# EAGLE design PS2Kbd (EAGLE 6.5.0)
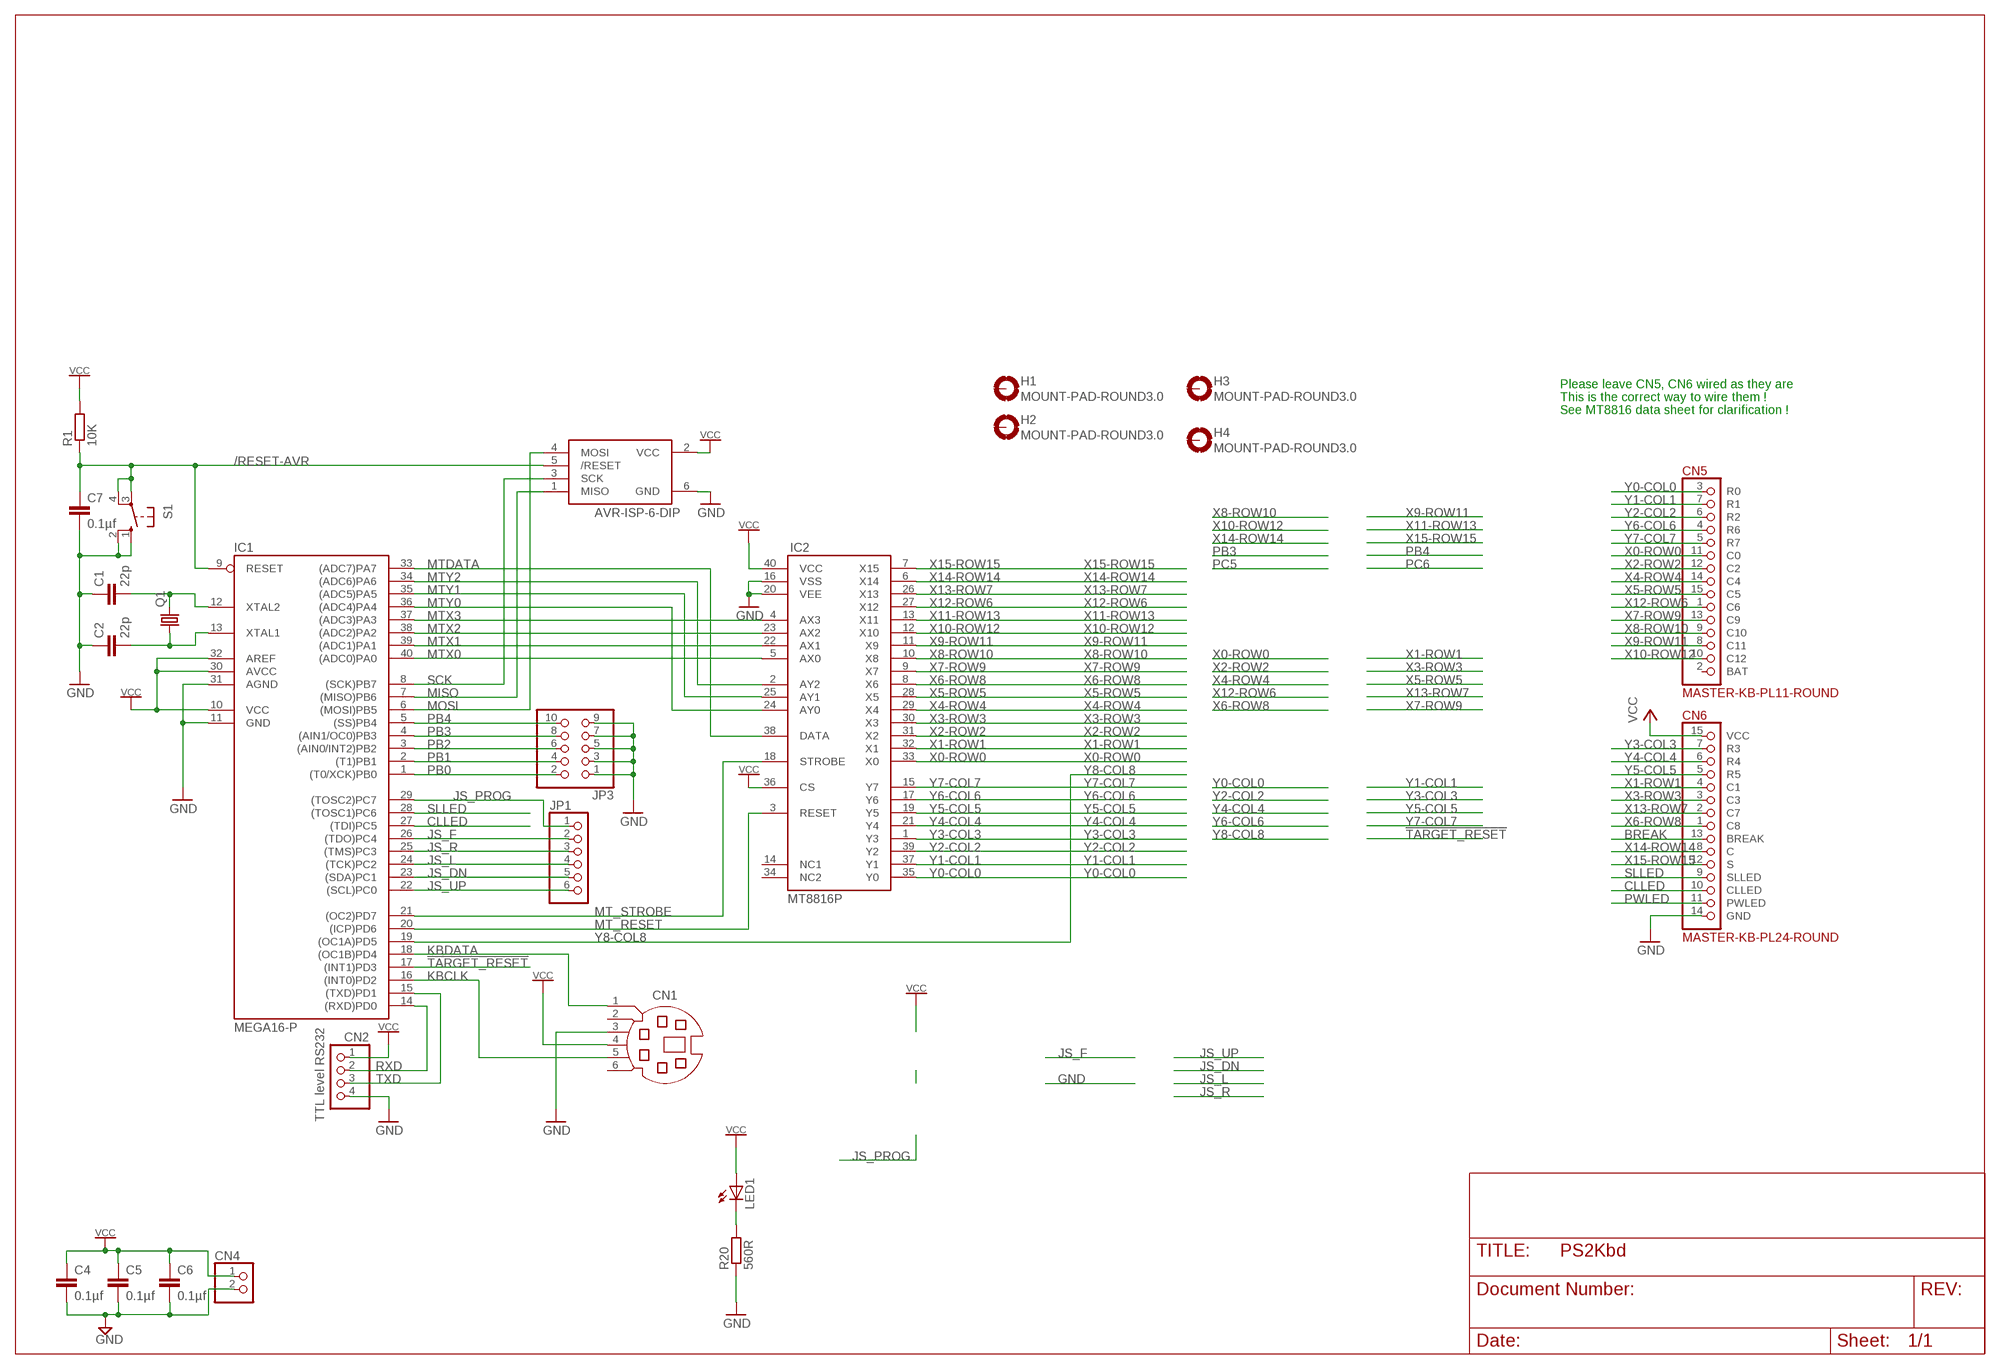
[diagram p0: schematic, sheet 1]

## Parts
C1  22p  C-EU025-025X050  [C025-025X050]
C2  22p  C-EU025-025X050  [C025-025X050]
C4  0.1µf  C-EU025-025X050  [C025-025X050]
C5  0.1µf  C-EU025-025X050  [C025-025X050]
C6  0.1µf  C-EU025-025X050  [C025-025X050]
C7  0.1µf  C-EU025-025X050  [C025-025X050]
CN1  MD06SS  [MDIN06SS]
CN2  PINHD-1X4  [1X04]
CN3  AVR-ISP-6-DIP  [2X3]
CN4  PINHD-1X2  [1X02]
CN5  MASTER-KB-PL11-ROUND  [1X15-ROUND]
CN6  MASTER-KB-PL24-ROUND  [1X15-ROUND]
H1  MOUNT-PAD-ROUND3.0  [3,0-PAD]
H2  MOUNT-PAD-ROUND3.0  [3,0-PAD]
H3  MOUNT-PAD-ROUND3.0  [3,0-PAD]
H4  MOUNT-PAD-ROUND3.0  [3,0-PAD]
IC1  MEGA16-P  [DIL40]
IC2  MT8816P  [DIL40]
JP1  PINHD-1X6  [1X06]
JP3  PINHD-2X5  [2X05]
LED1  LED3MM  [LED3MM]
Q1  CRYSTALHC49S  [HC49/S]
R1  10K  R-EU_0207/10  [0207/10]
R20  560R  R-EU_0207/10  [0207/10]
S1  10-XX  [B3F-10XX]

## Nets
!TARGET_RESET: IC1.17((INT1)PD3)
/RESET-AVR: C7.1 CN3.5(/RESET) IC1.9(RESET) R1.1 S1.3(P) S1.4(P1)
BREAK: CN6.13(BREAK)
CLLED: CN6.10(CLLED) IC1.27((TDI)PC5)
GND: C1.1 C2.1 C4.2 C5.2 C6.2 C7.2 CN1.3 CN2.4 CN3.6(GND) CN4.2 CN6.14(GND) IC1.11(GND) IC1.31(AGND) IC2.16(VSS) IC2.20(VEE) JP3.1 JP3.3 JP3.5 JP3.7 JP3.9 R20.1 S1.1(S) S1.2(S1)
JS_DN: IC1.23((SDA)PC1) JP1.5
JS_F: IC1.26((TDO)PC4) JP1.2
JS_L: IC1.24((TCK)PC2) JP1.4
JS_PROG: IC1.29((TOSC2)PC7) JP1.1
JS_R: IC1.25((TMS)PC3) JP1.3
JS_UP: IC1.22((SCL)PC0) JP1.6
KBCLK: CN1.5 IC1.16((INT0)PD2)
KBDATA: CN1.1 IC1.18((OC1B)PD4)
MISO: CN3.1(MISO) IC1.7((MISO)PB6)
MOSI: CN3.4(MOSI) IC1.6((MOSI)PB5)
MT_RESET: IC1.20((ICP)PD6) IC2.3(RESET)
MT_STROBE: IC1.21((OC2)PD7) IC2.18(STROBE)
MTDATA: IC1.33((ADC7)PA7) IC2.38(DATA)
MTX0: IC1.40((ADC0)PA0) IC2.5(AX0)
MTX1: IC1.39((ADC1)PA1) IC2.22(AX1)
MTX2: IC1.38((ADC2)PA2) IC2.23(AX2)
MTX3: IC1.37((ADC3)PA3) IC2.4(AX3)
MTY0: IC1.36((ADC4)PA4) IC2.24(AY0)
MTY1: IC1.35((ADC5)PA5) IC2.25(AY1)
MTY2: IC1.34((ADC6)PA6) IC2.2(AY2)
N$2: C1.2 IC1.12(XTAL2) Q1.2
N$3: C2.2 IC1.13(XTAL1) Q1.1
N$9: LED1.K(C) R20.2
PB0: IC1.1((T0/XCK)PB0) JP3.2
PB1: IC1.2((T1)PB1) JP3.4
PB2: IC1.3((AIN0/INT2)PB2) JP3.6
PB3: IC1.4((AIN1/OC0)PB3) JP3.8
PB4: IC1.5((SS)PB4) JP3.10
PWLED: CN6.11(PWLED)
RXD: CN2.2 IC1.14((RXD)PD0)
SCK: CN3.3(SCK) IC1.8((SCK)PB7)
SLLED: CN6.9(SLLED) IC1.28((TOSC1)PC6)
TXD: CN2.3 IC1.15((TXD)PD1)
VCC: C4.1 C5.1 C6.1 CN1.4 CN2.1 CN3.2(VCC) CN4.1 CN6.15(VCC) IC1.10(VCC) IC1.30(AVCC) IC1.32(AREF) IC2.36(CS) IC2.40(VCC) LED1.A R1.2
X0-ROW0: CN5.11(C0) IC2.33(X0)
X1-ROW1: CN6.4(C1) IC2.32(X1)
X2-ROW2: CN5.12(C2) IC2.31(X2)
X3-ROW3: CN6.3(C3) IC2.30(X3)
X4-ROW4: CN5.14(C4) IC2.29(X4)
X5-ROW5: CN5.15(C5) IC2.28(X5)
X6-ROW8: CN6.1(C8) IC2.8(X6)
X7-ROW9: CN5.13(C9) IC2.9(X7)
X8-ROW10: CN5.9(C10) IC2.10(X8)
X9-ROW11: CN5.8(C11) IC2.11(X9)
X10-ROW12: CN5.10(C12) IC2.12(X10)
X11-ROW13: IC2.13(X11)
X12-ROW6: CN5.1(C6) IC2.27(X12)
X13-ROW7: CN6.2(C7) IC2.26(X13)
X14-ROW14: CN6.8(C) IC2.6(X14)
X15-ROW15: CN6.12(S) IC2.7(X15)
Y0-COL0: CN5.3(R0) IC2.35(Y0)
Y1-COL1: CN5.7(R1) IC2.37(Y1)
Y2-COL2: CN5.6(R2) IC2.39(Y2)
Y3-COL3: CN6.7(R3) IC2.1(Y3)
Y4-COL4: CN6.6(R4) IC2.21(Y4)
Y5-COL5: CN6.5(R5) IC2.19(Y5)
Y6-COL6: CN5.4(R6) IC2.17(Y6)
Y7-COL7: CN5.5(R7) IC2.15(Y7)
Y8-COL8: IC1.19((OC1A)PD5)
Unconnected: CN1.2 CN1.6 CN5.2(BAT) H1.B3,0(MOUNT) H2.B3,0(MOUNT) H3.B3,0(MOUNT) H4.B3,0(MOUNT) IC2.14(NC1) IC2.34(NC2)

## Notes on the sheet
- Please leave CN5, CN6 wired as they are
- This is the correct way to wire them !
- See MT8816 data sheet for clarification !
- TTL level RS232

## Library data of the parts
C1 C2 C4-C7 = rcl:C-EU: CAPACITOR, European symbol
CN1 = con-yamaichi:MD06SS: YAMAICHI CONNECTOR; OC_FARNELL: unknown; OC_NEWARK: unknown
CN2 = pinhead-round:PINHD-1X4: PIN HEADER
CN3 = Conn AVR:AVR-ISP-6-DIP
CN4 = pinhead:PINHD-1X2: PIN HEADER
CN5 = Con-Acorn:MASTER-KB-PL11
CN6 = Con-Acorn:MASTER-KB-PL24
H1-H4 = holes:MOUNT-PAD-ROUND: MOUNTING PAD, round
IC1 = avr:MEGA16-P: MICROCONTROLLER 16 Kbytes FLASH 1 kbytes SRAM 512 bytes EEPROM USART 8-channel 10 bit ADC
IC2 = Zarlink-crosspoint:MT8816P: Zarlink MT8816P 8 line by 16 line analogue crosspoint switch
JP1 = pinhead-round:PINHD-1X6: PIN HEADER
JP3 = pinhead-round:PINHD-2X5: PIN HEADER
LED1 = led:LED: LED OSRAM: - CHIPLED LG R971, LG N971, LY N971, LG Q971, LY Q971, LO R971, LY R971 LH N974, LH R974 LS Q976, LO Q976, LY Q976 LO Q996 - Hyper CHIPLED LW Q18S LB Q993, LB Q99A, LB R99A - SideLED LS A670, LO A670, LY A670, LG A670, LP A670 LB A673, LV A673, LT A673, LW A673 LH A674 LY A675 LS A676, LA A676, LO A676, LY A676, LW A676 LS A679, LY A679, LG A679 - Hyper Micro SIDELED® LS Y876, LA Y876, LO Y876, LY Y876 LT Y87S - SmartLED LW L88C, LW L88S LB L89C, LB L89S, LG L890 LS L89K, LO L89K, LY L89K LS L896, LA L896, LO L896, LY L896 - TOPLED LS T670, LO T670, LY T670, LG T670, LP T670 LSG T670, LSP T670, LSY T670, LOP T670, LYG T670 LG T671, LOG T671, LSG T671 LB T673, LV T673, LT T673, LW T673 LH T674 LS T676, LA T676, LO T676, LY T676, LB T676, LH T676, LSB T676, LW T676 LB T67C, LV T67C, LT T67C, LS T67K, LO T67K, LY T67K, LW E67C LS E67B, LA E67B, LO E67B, LY E67B, LB E67C, LV E67C, LT E67C LW T67C LS T679, LY T679, LG T679 LS T770, LO T770, LY T770, LG T770, LP T770 LB T773, LV T773, LT T773, LW T773 LH T774 LS E675, LA E675, LY E675, LS T675 LS T776, LA T776, LO T776, LY T776, LB T776 LHGB T686 LT T68C, LB T68C - Hyper Mini TOPLED® LB M676 - Mini TOPLED Santana® LG M470 LS M47K, LO M47K, LY M47K Source: http://www.osram.convergy.de LUXEON: - LUMILED® LXK2-PW12-R00, LXK2-PW12-S00, LXK2-PW14-U00, LXK2-PW14-V00 LXK2-PM12-R00, LXK2-PM12-S00, LXK2-PM14-U00 LXK2-PE12-Q00, LXK2-PE12-R00, LXK2-PE12-S00, LXK2-PE14-T00, LXK2-PE14-U00 LXK2-PB12-K00, LXK2-PB12-L00, LXK2-PB12-M00, LXK2-PB14-N00, LXK2-PB14-P00, LXK2-PB14-Q00 LXK2-PR12-L00, LXK2-PR12-M00, LXK2-PR14-Q00, LXK2-PR14-R00 LXK2-PD12-Q00, LXK2-PD12-R00, LXK2-PD12-S00 LXK2-PH12-R00, LXK2-PH12-S00 LXK2-PL12-P00, LXK2-PL12-Q00, LXK2-PL12-R00 Source: www.luxeon.com KINGBRIGHT: KA-3528ASYC Source: www.kingbright.com
Q1 = crystal:CRYSTAL: CRYSTAL; OC_FARNELL: 1667008; OC_NEWARK: unknown
R1 R20 = rcl:R-EU_: RESISTOR, European symbol
S1 = switch-omron:10-XX: OMRON SWITCH; MPN: B3F-1000; OC_FARNELL: 176432; OC_NEWARK: 36M3542

## Board
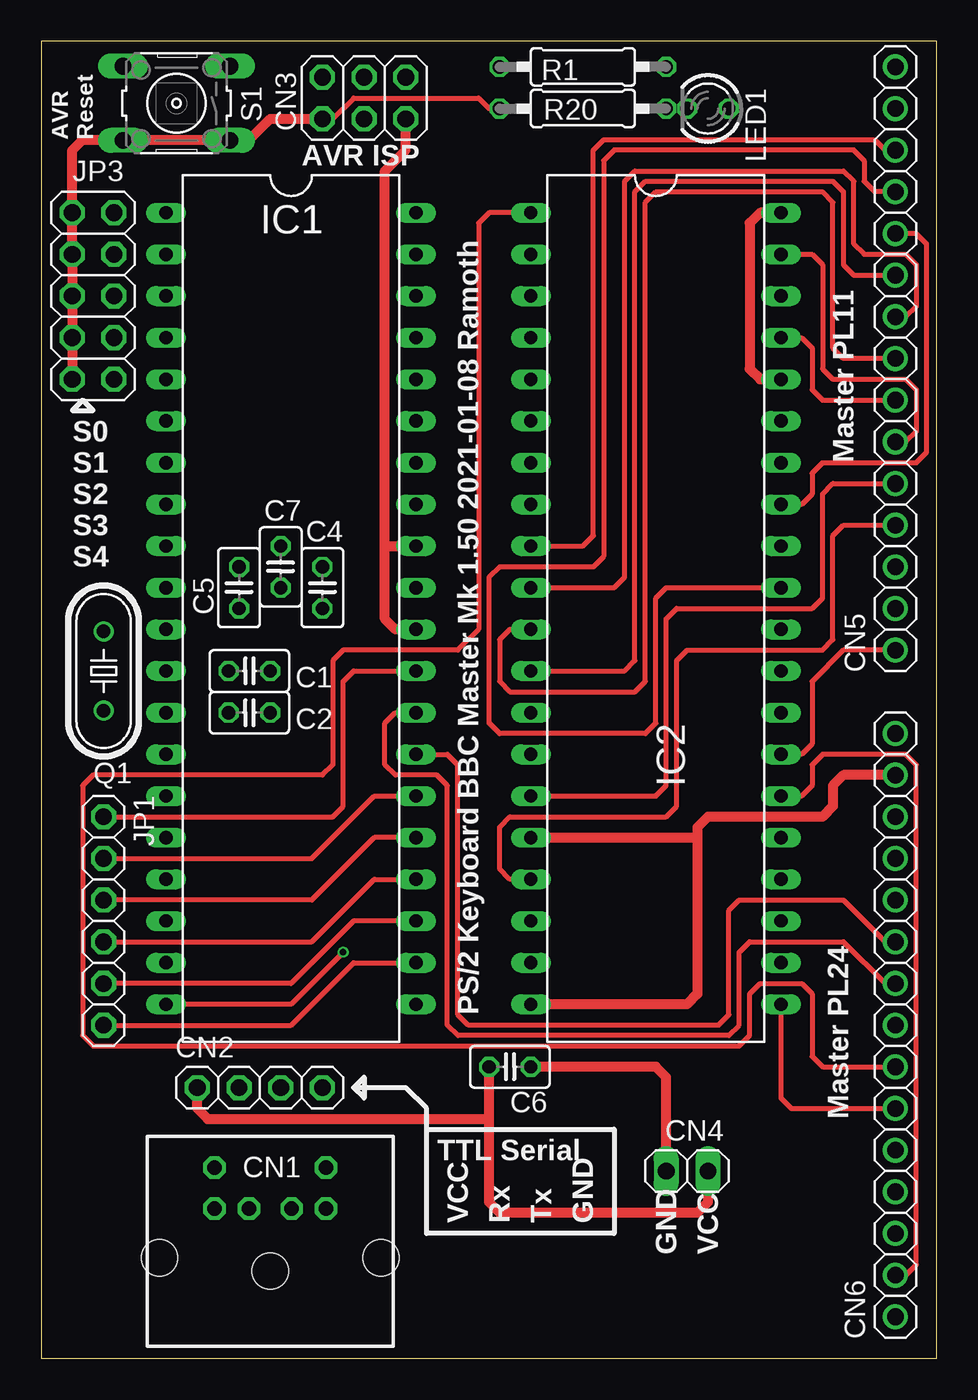
[diagram p1: board, top side]
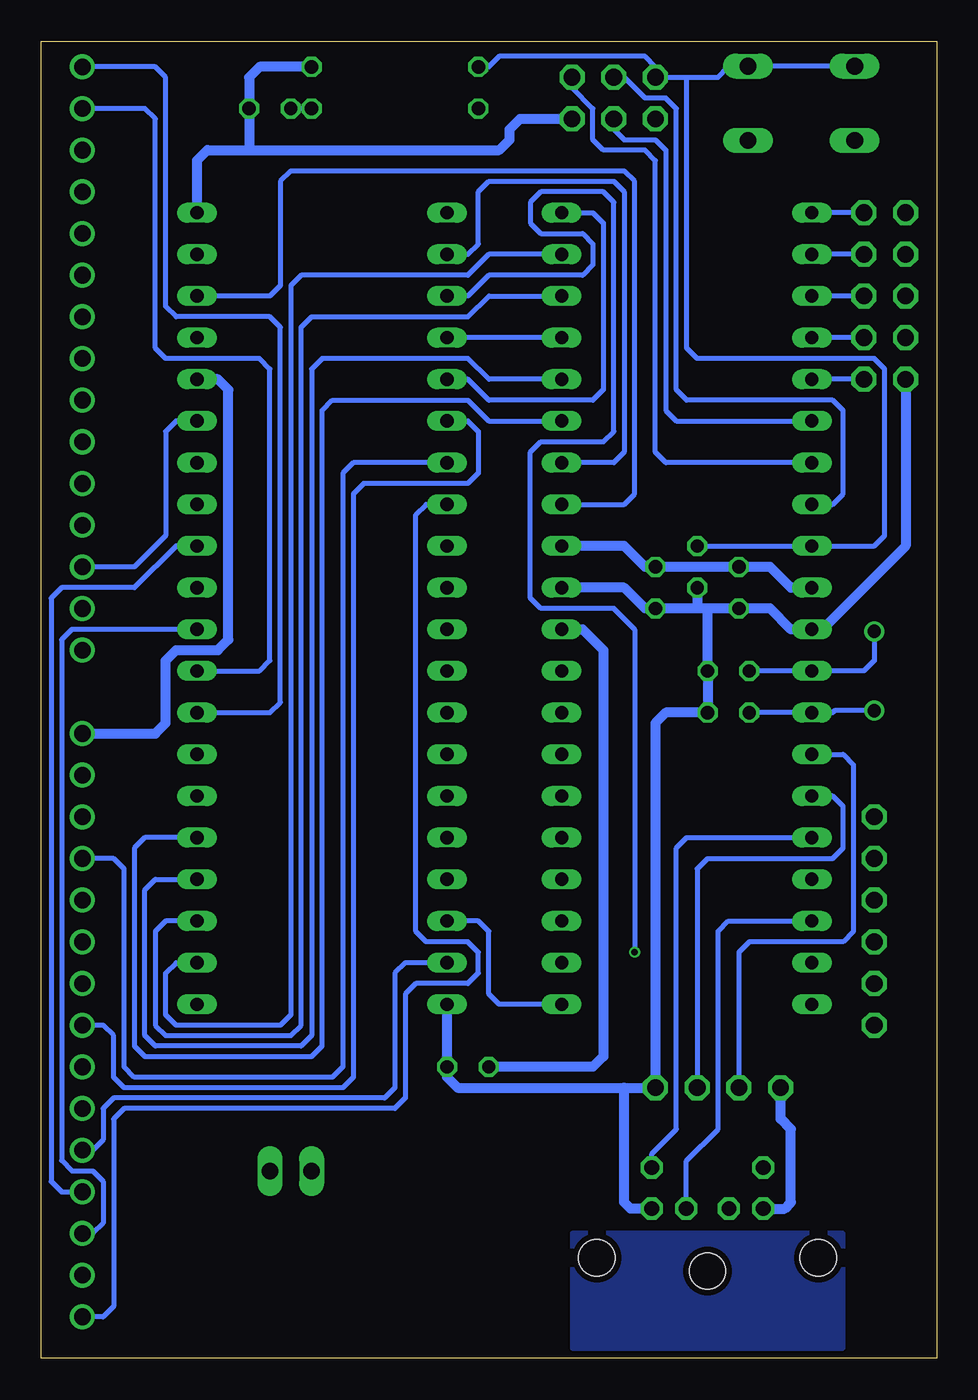
[diagram p2: board, bottom side, seen from below]

Size 54.59 x 80.31 mm. Coordinates in mm from the lower left corner, seen from the top.
Outline: 0,0 54.59,0 54.59,80.31 0,80.31 0,0
Copper layers (1*16): Top 0.035559375mm / dielectric 1.6mm / Bottom 0.035559375mm
Design rules "oshpark-2layer": minimum track width 6mil, minimum drill 10mil, track to track 6mil, track to pad 6mil, pad to pad 6mil, via to via 6mil, smd to smd 6mil, copper to edge 15mil, drill to drill 6mil, minimum pad ring 5mil, minimum via ring 5mil, stop-mask expansion 2.5mil, vias tented up to drill 0mil, thermal gap 10mil

### Footprints (pad centres in the part's own frame; a part is rotated, then mirrored left to right if it is on the bottom)
C025-025X050 = drill 0.813 octagon: 1 -1.27,0; 2 1.27,0
MDIN06SS = drill 0.9 octagon: 1 1.3,8.5; 2 -1.3,8.5; 3 3.4,8.5; 4 -3.4,8.5; 5 3.4,11; 6 -3.4,11 | hole 2.2: -6.75,5.5; 0,4.7; 6.75,5.5
1X04 = drill 1.016 octagon: 1 -3.81,0; 2 -1.27,0; 3 1.27,0; 4 3.81,0
2X3 = drill 1.016 octagon: 1 -2.54,-1.27; 2 -2.54,1.27; 3 0,-1.27; 4 0,1.27; 5 2.54,-1.27; 6 2.54,1.27
1X02 = drill 1.016 long: 1 -1.27,0; 2 1.27,0
1X15-ROUND = drill 1.016: 1 -17.78,0; 2 -15.24,0; 3 -12.7,0; 4 -10.16,0; 5 -7.62,0; 6 -5.08,0; 7 -2.54,0; 8 0,0; 9 2.54,0; 10 5.08,0; 11 7.62,0; 12 10.16,0; 13 12.7,0; 14 15.24,0; 15 17.78,0
3,0-PAD = drill 3 pad 5.842: B3,0 0,0
DIL40 = drill 0.813 long: 1 -24.13,-7.62; 2 -21.59,-7.62; 3 -19.05,-7.62; 4 -16.51,-7.62; 5 -13.97,-7.62; 6 -11.43,-7.62; 7 -8.89,-7.62; 8 -6.35,-7.62; 9 -3.81,-7.62; 10 -1.27,-7.62; 11 1.27,-7.62; 12 3.81,-7.62; 13 6.35,-7.62; 14 8.89,-7.62; 15 11.43,-7.62; 16 13.97,-7.62; 17 16.51,-7.62; 18 19.05,-7.62; 19 21.59,-7.62; 20 24.13,-7.62; 21 24.13,7.62; 22 21.59,7.62; 23 19.05,7.62; 24 16.51,7.62; 25 13.97,7.62; 26 11.43,7.62; 27 8.89,7.62; 28 6.35,7.62; 29 3.81,7.62; 30 1.27,7.62; 31 -1.27,7.62; 32 -3.81,7.62; 33 -6.35,7.62; 34 -8.89,7.62; 35 -11.43,7.62; 36 -13.97,7.62; 37 -16.51,7.62; 38 -19.05,7.62; 39 -21.59,7.62; 40 -24.13,7.62
1X06 = drill 1.016 octagon: 1 -6.35,0; 2 -3.81,0; 3 -1.27,0; 4 1.27,0; 5 3.81,0; 6 6.35,0
2X05 = drill 1.016 octagon: 1 -5.08,-1.27; 2 -5.08,1.27; 3 -2.54,-1.27; 4 -2.54,1.27; 5 0,-1.27; 6 0,1.27; 7 2.54,-1.27; 8 2.54,1.27; 9 5.08,-1.27; 10 5.08,1.27
LED3MM = drill 0.813 octagon: A -1.27,0; K 1.27,0
HC49/S = drill 0.813: 1 -2.413,0; 2 2.413,0
0207/10 = drill 0.813 octagon: 1 -5.08,0; 2 5.08,0
B3F-10XX = drill 1.016 long: 1 -3.251,2.261; 2 3.251,2.261; 3 -3.251,-2.261; 4 3.251,-2.261

### Placement (x,y rotation side)
C1  12.7,41.91 180 top
C2  12.7,39.37 180 top
C4  17.14,46.99 270 top
C5  12.06,46.99 270 top
C6  28.57,17.78 0 top
C7  14.61,48.26 270 top
CN1  13.97,0.64 0 top
CN2  13.34,16.51 0 top
CN3  19.68,76.83 180 top
CN4  39.37,11.43 180 top
CN5  52.07,60.96 90 top
CN6  52.07,20.32 90 top
H1  124.64,29.77 0 top  (outside the outline)
H2  124.64,38.59 0 top  (outside the outline)
H3  124.38,11.98 0 top  (outside the outline)
H4  124.38,20.8 0 top  (outside the outline)
IC1  15.24,45.72 270 top
IC2  37.47,45.72 270 top
JP1  3.81,26.67 270 top
JP3  3.17,64.77 270 top
LED1  40.64,76.2 180 top
Q1  3.81,41.91 90 top
R1  33.02,78.74 0 top
R20  33.02,76.2 0 top
S1  8.26,76.52 180 top

### Tracks (layer width: path | path; a pad name or v marks a point on that pad's centre or on a via)
/RESET-AVR
  Bottom 0.305: 15.24,78.11 CN3.5 17.14,78.74 17.78,79.38 26.67,79.38 27.3,78.74 R1.1 | 15.24,78.11 13.34,78.11 12.7,78.74 11.54,78.74 S1.3 S1.4 | C7.1 IC1.9 3.81,49.53 3.17,50.16 3.17,60.33 3.81,60.96 14.61,60.96 15.24,61.59 15.24,78.11
CLLED
  Top 0.305: CN6.10 51.44,25.4 48.9,27.94 42.55,27.94 41.91,27.3 41.91,20.95 41.27,20.32 26.04,20.32 25.4,20.95 25.4,36.2 24.77,36.83 IC1.27
GND
  Top 0.305: CN3.6 17.78,75.56 19.05,76.83 26.67,76.83 27.3,76.2 R20.1
  Top 0.61: JP3.9 JP3.7 JP3.5 JP3.3 JP3.1 1.91,73.66 2.5,74.26 S1.2 S1.1 12.66,74.26 13.97,75.56 CN3.6 | CN6.14 48.9,35.56 48.26,34.92 48.26,33.66 47.62,33.02 40.64,33.02 40.01,32.38 40.01,31.75 | IC2.20 39.37,21.59 40.01,22.23 40.01,31.75 | CN4.2 38.1,17.14 37.47,17.78 C6.2 | IC2.16 40.01,31.75
  Bottom 0.61: 13.97,45.72 C5.2 10.16,45.72 8.89,44.45 IC1.11 6.99,44.45 1.91,49.53 JP3.9 | 13.97,45.72 14.61,45.72 | 14.61,45.72 C4.2 17.78,45.72 19.05,46.99 IC1.31 | C7.2 14.61,45.72 | CN1.3 18.66,9.13 19.05,9.53 19.05,16.51 | 19.05,16.51 29.21,16.51 29.84,17.14 C6.2 IC2.20 | 13.97,45.72 C1.1 C2.1 16.51,39.37 17.14,38.73 CN2.4 19.05,16.51
JS_DN
  Top 0.305: IC1.23 19.05,26.67 15.24,22.86 JP1.5
JS_F
  Top 0.305: JP1.2 16.51,30.48 20.32,34.29 IC1.26
JS_L
  Top 0.305: JP1.4 16.51,25.4 20.32,29.21 IC1.24
JS_PROG
  Top 0.305: JP1.1 17.78,33.02 18.41,33.66 18.41,41.27 19.05,41.91 IC1.29
JS_R
  Top 0.305: IC1.25 20.32,31.75 16.51,27.94 JP1.3
JS_UP
  Top 0.305: JP1.6 15.24,20.32 19.05,24.13 IC1.22
KBCLK
  Bottom 0.305: CN1.5 17.37,12.47 15.88,13.97 15.88,31.11 15.24,31.75 IC1.16
KBDATA
  Bottom 0.305: CN1.1 15.27,12.04 13.34,13.97 13.34,26.04 12.7,26.67 IC1.18
MISO
  Bottom 0.305: IC1.7 16.51,54.61 17.14,55.24 17.14,73.03 17.78,73.66 20.32,73.66 20.95,74.3 20.95,76.2 22.23,77.47 CN3.1
MOSI
  Bottom 0.305: CN3.4 19.68,74.93 19.05,74.3 17.14,74.3 16.51,73.66 16.51,57.78 15.88,57.15 IC1.6
MT_RESET  (via drill 0.4)
  Top 0.305: v18.41,24.77 15.24,21.59 IC1.20
  Bottom 0.305: IC2.3 28.57,64.77 27.3,66.04 21.59,66.04 20.95,66.67 20.95,67.94 21.59,68.58 24.13,68.58 24.77,69.22 24.77,70.48 24.13,71.12 20.32,71.12 19.68,70.48 19.68,56.52 20.32,55.88 24.13,55.88 24.77,55.24 24.77,46.35 24.13,45.72 19.68,45.72 18.41,44.45 v18.41,24.77
MT_STROBE
  Bottom 0.305: IC1.21 26.67,21.59 27.3,22.23 27.3,26.04 27.94,26.67 IC2.18
MTDATA
  Bottom 0.305: IC1.33 19.05,52.07 18.41,52.7 18.41,71.75 19.05,72.39 39.37,72.39 40.01,71.75 40.01,65.41 40.64,64.77 IC2.38
MTX0
  Bottom 0.305: IC1.40 20.95,69.85 20.32,69.22 20.32,59.05 20.95,58.42 27.3,58.42 28.57,59.69 IC2.5
MTX1
  Bottom 0.305: IC1.39 27.3,67.31 28.57,66.04 38.73,66.04 39.37,65.41 39.37,20.95 40.01,20.32 46.35,20.32 46.99,20.95 46.99,23.5 46.35,24.13 IC2.22
MTX2
  Bottom 0.305: IC2.23 46.99,26.67 47.62,26.04 47.62,20.32 46.99,19.68 39.37,19.68 38.73,20.32 38.73,62.87 38.1,63.5 28.57,63.5 27.3,64.77 IC1.38
MTX3
  Bottom 0.305: IC1.37 IC2.4
MTY0
  Bottom 0.305: IC1.36 27.3,59.69 28.57,60.96 37.47,60.96 38.1,60.33 38.1,19.68 38.73,19.05 47.62,19.05 48.26,19.68 48.26,28.57 47.62,29.21 IC2.24
MTY1
  Bottom 0.305: IC2.25 48.26,31.75 48.9,31.11 48.9,19.05 48.26,18.41 38.1,18.41 37.47,19.05 37.47,57.78 36.83,58.42 28.57,58.42 27.3,57.15 IC1.35
MTY2
  Bottom 0.305: IC2.2 28.57,67.31 27.94,67.94 27.94,71.12 27.3,71.75 19.68,71.75 19.05,71.12 19.05,55.24 19.68,54.61 IC1.34
N$2
  Bottom 0.305: C1.2 IC1.12 4.45,41.91 3.81,42.55 Q1.2
N$3
  Bottom 0.305: C2.2 IC1.13 6.35,39.37 6.22,39.5 Q1.1
N$4
  pour Bottom: 5.71,0.64 5.71,7.62 22.23,7.62 22.23,0.64
N$9
  Bottom 0.305: R20.2 LED1.K
PB0
  Bottom 0.305: JP3.2 IC1.1
PB1
  Bottom 0.305: JP3.4 IC1.2
PB2
  Bottom 0.305: JP3.6 IC1.3
PB3
  Bottom 0.305: JP3.8 IC1.4
PB4
  Bottom 0.305: JP3.10 IC1.5
RXD
  Bottom 0.305: IC1.14 5.71,36.83 5.08,36.2 5.08,26.04 5.71,25.4 11.43,25.4 12.06,24.77 CN2.2
SCK
  Bottom 0.305: IC1.8 6.35,52.07 5.71,52.7 5.71,57.78 6.35,58.42 15.24,58.42 15.88,59.05 15.88,76.2 16.51,76.83 17.78,76.83 19.05,78.11 CN3.3
SLLED
  Top 0.305: CN6.9 51.44,22.86 48.9,25.4 43.18,25.4 42.55,24.77 42.55,20.32 41.91,19.68 25.4,19.68 24.77,20.32 24.77,34.92 24.13,35.56 21.59,35.56 20.95,36.2 20.95,38.73 21.59,39.37 IC1.28
TXD
  Bottom 0.305: IC1.15 6.35,34.29 5.71,33.66 5.71,31.11 6.35,30.48 13.97,30.48 14.61,29.84 CN2.3
VCC
  Top 0.61: IC2.40 43.81,69.85 43.18,69.22 43.18,60.33 43.81,59.69 IC2.36 | 27.3,14.61 10.16,14.61 9.53,15.24 CN2.1 | CN4.1 40.64,9.53 40.01,8.89 27.94,8.89 27.3,9.53 27.3,14.61 | 27.3,14.61 C6.1 | IC1.30 21.59,44.45 20.95,45.09 20.95,49.53 | 20.95,49.53 20.95,72.39 22.23,73.66 CN3.2 | 20.95,49.53 IC1.32
  Bottom 0.61: IC1.10 8.89,46.99 10.16,48.26 C5.1 C4.1 17.78,48.26 19.05,49.53 IC1.32 | CN6.15 47.62,38.1 46.99,38.73 46.99,42.55 46.35,43.18 43.81,43.18 43.18,43.81 43.18,59.05 43.81,59.69 IC2.36 | CN1.4 9.28,9.13 8.89,9.53 8.89,13.97 9.53,14.61 CN2.1 | IC2.40 45.09,73.03 44.45,73.66 41.91,73.66 | 41.91,73.66 26.67,73.66 26.04,74.3 26.04,74.93 25.4,75.56 CN3.2 | 41.91,73.66 LED1.A 41.91,78.11 41.27,78.74 R1.2 | IC1.30 21.59,44.45 20.32,43.18 20.32,18.41 20.95,17.78 C6.1
X0-ROW0
  Top 0.305: CN5.11 53.34,68.58 53.98,67.94 53.98,55.24 53.34,54.61 47.62,54.61 46.99,53.98 46.99,52.7 46.35,52.07 IC2.33
X1-ROW1
  Bottom 0.305: IC2.32 46.35,49.53 48.9,46.99 53.34,46.99 53.98,46.35 53.98,10.79 53.34,10.16 CN6.4
X2-ROW2
  Top 0.305: CN5.12 50.8,71.12 50.16,71.75 50.16,73.03 49.53,73.66 34.92,73.66 34.29,73.03 34.29,48.9 33.66,48.26 27.94,48.26 27.3,47.62 27.3,38.73 27.94,38.1 36.83,38.1 37.47,38.73 37.47,46.35 38.1,46.99 IC2.31
X3-ROW3
  Bottom 0.305: IC2.30 52.7,44.45 53.34,43.81 53.34,12.06 52.7,11.43 51.44,11.43 50.8,10.79 50.8,8.26 51.44,7.62 CN6.3
X4-ROW4
  Bottom 0.305: IC2.29 41.27,41.91 40.64,42.55 40.64,60.33 41.27,60.96 46.99,60.96 47.62,61.59 47.62,75.56 48.26,76.2 CN5.14
X5-ROW5
  Bottom 0.305: IC2.28 40.64,39.37 40.01,40.01 40.01,62.87 40.64,63.5 46.35,63.5 46.99,64.14 46.99,78.11 47.62,78.74 CN5.15
X6-ROW8
  Bottom 0.305: CN6.1 50.8,2.54 50.16,3.17 50.16,14.61 49.53,15.24 33.02,15.24 32.38,15.88 32.38,22.23 31.75,22.86 28.57,22.86 27.94,23.5 27.94,24.77 28.57,25.4 31.11,25.4 31.75,26.04 31.75,51.44 31.11,52.07 IC2.8
X7-ROW9
  Top 0.305: IC2.9 33.02,49.53 33.66,50.16 33.66,73.66 34.29,74.3 50.8,74.3 51.44,73.66 CN5.13
X8-ROW10
  Top 0.305: IC2.10 34.92,46.99 35.56,47.62 35.56,71.75 36.2,72.39 48.9,72.39 49.53,71.75 49.53,67.94 50.16,67.31 52.7,67.31 53.34,66.67 53.34,64.14 52.7,63.5 CN5.9
X9-ROW11
  Top 0.305: IC2.11 28.57,44.45 27.94,43.81 27.94,41.27 28.57,40.64 36.2,40.64 36.83,41.27 36.83,70.48 37.47,71.12 47.62,71.12 48.26,70.48 48.26,61.59 48.9,60.96 CN5.8
X10-ROW12
  Top 0.305: IC2.12 35.56,41.91 36.2,42.55 36.2,71.12 36.83,71.75 48.26,71.75 48.9,71.12 48.9,66.67 49.53,66.04 CN5.10
X12-ROW6
  Top 0.305: CN5.1 48.9,43.18 46.99,41.27 46.99,37.47 46.35,36.83 IC2.27
X13-ROW7
  Top 0.305: CN6.2 52.7,5.08 53.34,5.71 53.34,36.2 52.7,36.83 47.62,36.83 46.99,36.2 46.99,34.92 46.35,34.29 IC2.26
X14-ROW14
  Bottom 0.305: IC2.6 28.57,57.15 27.94,56.52 27.94,53.98 28.57,53.34 34.92,53.34 35.56,52.7 35.56,17.14 36.2,16.51 49.53,16.51 50.16,17.14 50.16,19.68 50.8,20.32 CN6.8
X15-ROW15
  Bottom 0.305: IC2.7 35.56,54.61 36.2,53.98 36.2,17.78 36.83,17.14 48.9,17.14 49.53,17.78 49.53,29.84 50.16,30.48 CN6.12
Y0-COL0
  Bottom 0.305: IC2.35 46.35,57.15 46.99,56.52 46.99,50.16 48.9,48.26 CN5.3
Y1-COL1
  Top 0.305: IC2.37 46.35,62.23 46.99,61.59 46.99,59.05 47.62,58.42 CN5.7
Y2-COL2
  Top 0.305: IC2.39 46.99,67.31 47.62,66.67 47.62,60.33 48.26,59.69 52.7,59.69 53.34,59.05 53.34,56.52 52.7,55.88 CN5.6
Y3-COL3
  Top 0.305: IC2.1 27.3,69.85 26.67,69.22 26.67,44.45 25.4,43.18 18.41,43.18 17.78,42.55 17.78,36.2 17.14,35.56 3.17,35.56 2.54,34.92 2.54,19.68 3.17,19.05 42.55,19.05 43.18,19.68 43.18,22.23 43.81,22.86 46.35,22.86 46.99,22.23 46.99,18.41 47.62,17.78 CN6.7
Y4-COL4
  Top 0.305: IC2.21 45.09,15.88 45.72,15.24 CN6.6
Y5-COL5
  Bottom 0.305: IC2.19 32.38,24.13 33.02,23.5 33.02,16.51 33.66,15.88 50.16,15.88 50.8,15.24 50.8,13.34 51.44,12.7 CN6.5
Y6-COL6
  Top 0.305: CN5.4 48.9,50.8 48.26,50.16 48.26,43.81 47.62,43.18 39.37,43.18 38.73,42.55 38.73,33.66 38.1,33.02 28.57,33.02 27.94,32.38 27.94,29.84 28.57,29.21 IC2.17
Y7-COL7
  Top 0.305: IC2.15 37.47,34.29 38.1,34.92 38.1,45.09 38.73,45.72 46.99,45.72 47.62,46.35 47.62,52.7 48.26,53.34 CN5.5

### Text on the board
tPlace: AVR / Reset | AVR ISP | S0 | Master PL11 | S1 | S2 | S3 | S4 | PS/2 Keyboard BBC Master Mk 1.50 2021-01-08 Ramoth | Master PL24 | TTL Serial | VCC | Rx | Tx | GND | GND | VCC